# Altium schematic sheet LPCXpresso55SXX_POWER-USB.SchDoc
size A3; CheckedBy: José Ogando; Engineer: Eduardo Teofilo; Revision: A2; SheetNumber: 2; SheetTotal: 8
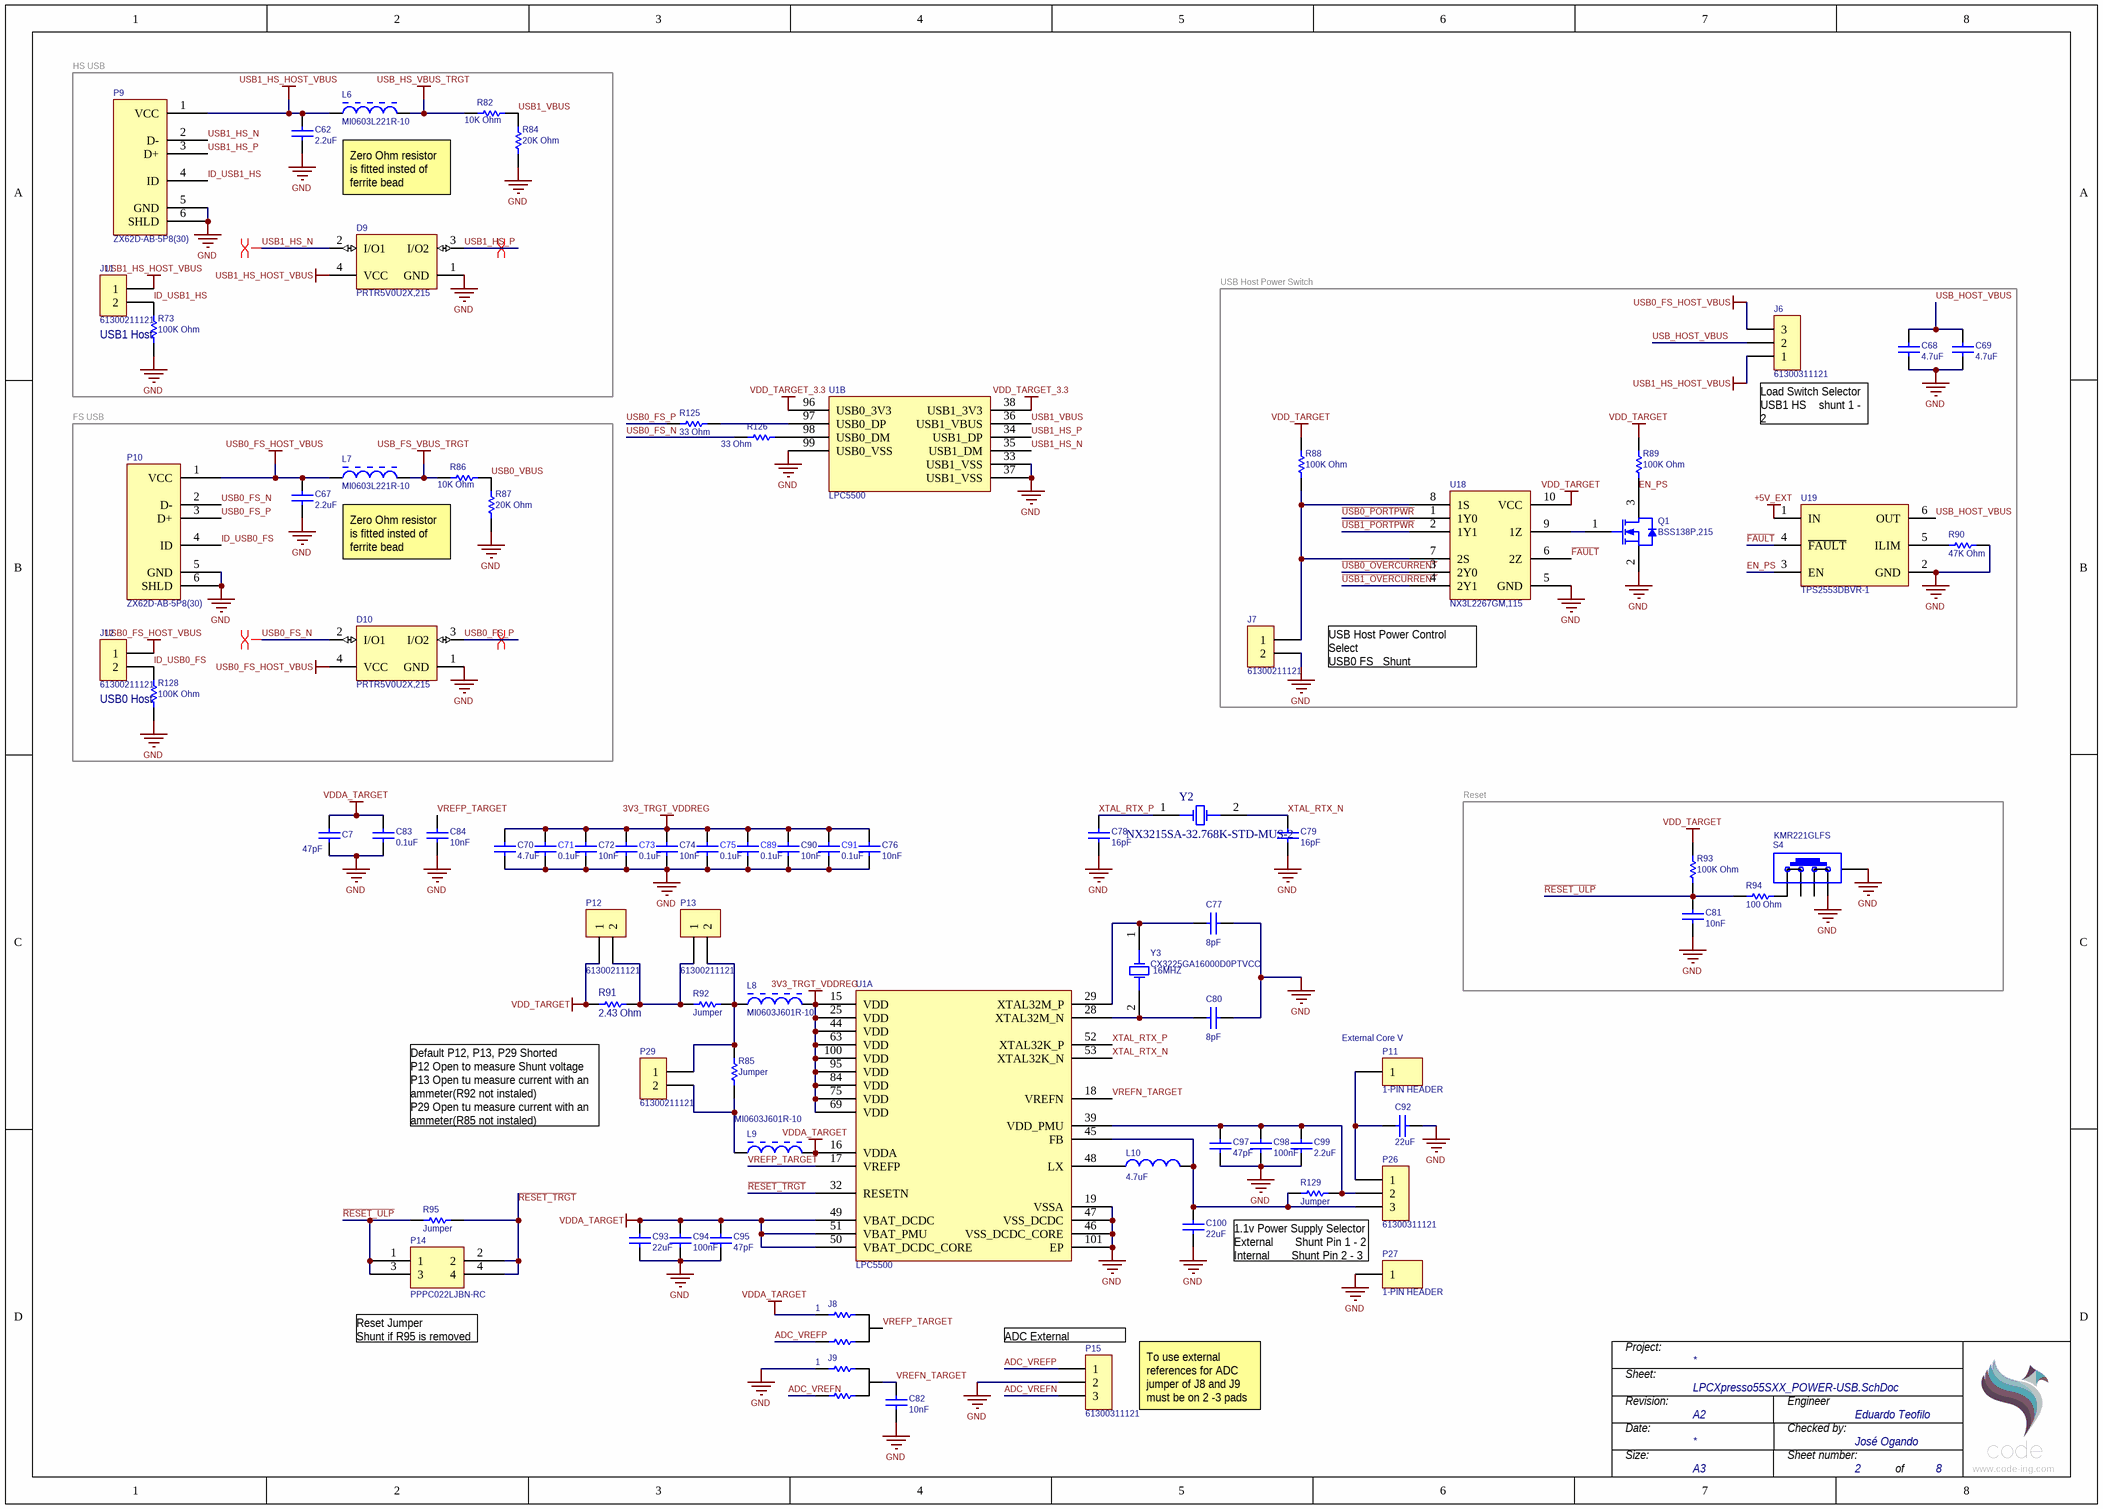
[diagram p0: LPCXpresso55SXX_POWER-USB.SchDoc]

## Parts
C7  value 47pF  [CAPC0402(1005)60_L]  (hidden comment: CAP 47pF 16V 0402(1005))
C62  value 2.2uF  [CAPC0402(1005)60_L]  (hidden comment: CAP 2.2uF 10V 0402(1005))
C67  value 2.2uF  [CAPC0402(1005)60_L]  (hidden comment: CAP 2.2uF 10V 0402(1005))
C68  value 4.7uF  [CAPC0603(1608)100_L]  (hidden comment: CAP 4.7uF 10V 0603(1608))
C69  value 4.7uF  [CAPC0603(1608)100_L]  (hidden comment: CAP 4.7uF 10V 0603(1608))
C70  value 4.7uF  [CAPC0603(1608)100_L]  (hidden comment: CAP 4.7uF 10V 0603(1608))
C71  value 0.1uF  [CAPC1005]  (hidden comment: CC0402KRX7R7BB104)
C72  value 10nF  [CAPC0402(1005)60_L]  (hidden comment: CAP 10nF 25V 0402(1005))
C73  value 0.1uF  [CAPC1005]  (hidden comment: CC0402KRX7R7BB104)
C74  value 10nF  [CAPC0402(1005)60_L]  (hidden comment: CAP 10nF 25V 0402(1005))
C75  value 0.1uF  [CAPC1005]  (hidden comment: CC0402KRX7R7BB104)
C76  value 10nF  [CAPC0402(1005)60_L]  (hidden comment: CAP 10nF 25V 0402(1005))
C77  value 8pF  [0402_L]  (hidden comment: GRM1555C1E8R0CA01D)
C78  value 16pF  [CAPC0402(1005)60_L]  (hidden comment: CAP 16pF 25V 0402(1005))
C79  value 16pF  [CAPC0402(1005)60_L]  (hidden comment: CAP 16pF 25V 0402(1005))
C80  value 8pF  [0402_L]  (hidden comment: GRM1555C1E8R0CA01D)
C81  value 10nF  [CAPC0402(1005)60_L]  (hidden comment: CAP 10nF 25V 0402(1005))
C82  value 10nF  [CAPC0402(1005)60_L]  (hidden comment: CAP 10nF 25V 0402(1005))
C83  value 0.1uF  [CAPC1005]  (hidden comment: CC0402KRX7R7BB104)
C84  value 10nF  [CAPC0402(1005)60_L]  (hidden comment: CAP 10nF 25V 0402(1005))
C89  value 0.1uF  [CAPC1005]  (hidden comment: CC0402KRX7R7BB104)
C90  value 10nF  [CAPC0402(1005)60_L]  (hidden comment: CAP 10nF 25V 0402(1005))
C91  value 0.1uF  [CAPC1005]  (hidden comment: CC0402KRX7R7BB104)
C92  value 22uF  [CAPC0805(2012)145_L]  (hidden comment: CAP 22uF 16V 0805(2012))
C93  value 22uF  [CAPC0805(2012)145_L]  (hidden comment: CAP 22uF 16V 0805(2012))
C94  value 100nF  [CAPC0603(1608)100_L]  (hidden comment: CAP 100nF 25V 0603(1608))
C95  value 47pF  [CAPC0603(1608)100_L]  (hidden comment: CAP 47pF 16V 0603(1608))
C97  value 47pF  [CAPC0603(1608)100_L]  (hidden comment: CAP 47pF 16V 0603(1608))
C98  value 100nF  [CAPC0603(1608)100_L]  (hidden comment: CAP 100nF 25V 0603(1608))
C99  value 2.2uF  [CAPC0402(1005)60_L]  (hidden comment: CAP 2.2uF 10V 0402(1005))
C100  value 22uF  [CAPC0805(2012)145_L]  (hidden comment: CAP 22uF 16V 0805(2012))
D9  PRTR5V0U2X,215  [NXP-SOT143B-4_V]
D10  PRTR5V0U2X,215  [NXP-SOT143B-4_V]
J6  61300311121  [61300311121]
J7  61300211121  [61300211121]
J8  Resistor - Jumper  [0402_R - JMP]  (value not drawn)
J9  Resistor - Jumper  [0402_R - JMP]  (value not drawn)
J11  61300211121  [61300211121]
J12  61300211121  [61300211121]
L6  MI0603L221R-10  [LIRD-HZ0603C601R-10-2_V]
L7  MI0603L221R-10  [LIRD-HZ0603C601R-10-2_V]
L8  MI0603J601R-10  [LIRD-MI0603J601R-10_V]
L9  MI0603J601R-10  [LIRD-MI0603J601R-10_V]
L10  value 4.7uF  [0805(2012)]  (hidden comment: MLZ2012M4R7HT000)
P9  ZX62D-AB-5P8(30)  [ZX62D-AB-5P8(30)]
P10  ZX62D-AB-5P8(30)  [ZX62D-AB-5P8(30)]
P11  1-PIN HEADER  [HDR1X1]
P12  61300211121  [61300211121]
P13  61300211121  [61300211121]
P14  PPPC022LJBN-RC  [PPPC022LJBN-RC]
P15  61300311121  [61300311121]
P26  61300311121  [61300311121]
P27  1-PIN HEADER  [HDR1X1]
P29  61300211121  [61300211121]
Q1  BSS138P,215  [NXP-SOT23_N]
R73  value 100K Ohm  [RESC1005X40X25LL05T05]  (hidden comment: ERJ-2RKF1003X)
R82  value 10K Ohm  [RESC0402(1005)_N]  (hidden comment: 10K 1% 0402(1005))
R84  value 20K Ohm  [RESC0402(1005)_M]  (hidden comment: 20K 1% 0402(1005))
R85  Jumper  [RESC0402(1005)_L]
R86  value 10K Ohm  [RESC0402(1005)_N]  (hidden comment: 10K 1% 0402(1005))
R87  value 20K Ohm  [RESC0402(1005)_M]  (hidden comment: 20K 1% 0402(1005))
R88  value 100K Ohm  [RESC1005X40X25LL05T05]  (hidden comment: ERJ-2RKF1003X)
R89  value 100K Ohm  [RESC1005X40X25LL05T05]  (hidden comment: ERJ-2RKF1003X)
R90  value 47K Ohm  [RESC0402(1005)_L]  (hidden comment: 47K 1% 0402(1005))
R91  value 2.43 Ohm  [RESC0402(1005)_L]  (hidden comment: 2R43 1% 0402(1005))
R92  Jumper  [RESC0402(1005)_L]
R93  value 100K Ohm  [RESC1005X40X25LL05T05]  (hidden comment: ERJ-2RKF1003X)
R94  value 100 Ohm  [RESC0402(1005)_L]  (hidden comment: 100R 5% 0402(1005))
R95  Jumper  [RESC0402(1005)_L]
R125  value 33 Ohm  [RESC0402(1005)_L]  (hidden comment: 33R 1% 0402(1005))
R126  value 33 Ohm  [RESC0402(1005)_L]  (hidden comment: 33R 1% 0402(1005))
R128  value 100K Ohm  [RESC1005X40X25LL05T05]  (hidden comment: ERJ-2RKF1003X)
R129  Jumper  [RESC0402(1005)_L]
S4  KMR221GLFS  [KMR221GLFS]
U1  LPC5500  [LQFP EP 100]  (parts A,B of 4)
U18  NX3L2267GM,115  [XQFN10]
U19  TPS2553DBVR-1  [DBV0006A_N]
Y2  NX3215SA-32.768K-STD-MUS-2  [2-SMD 3.2x1.5mm]
Y3  CX3225GA16000D0PTVCC  value 16MHZ  [CX3225GA]

## Blocks framed on the sheet
USB1 Host: C62 D9 J11 L6 P9 R73 R82 R84
USB Host Power Switch: C68 C69 J6 J7 Q1 R88-R90 U18 U19
USB0 Host: C67 D10 J12 L7 P10 R86 R87 R128
Reset: C81 R93 R94 S4

## Nets
3V3_TRGT_VDDREG: C70.2 C71.1 C72.2 C73.1 C74.2 C75.1 C76.2 C89.1 C90.2 C91.1 L8.2 U1.15(VDD) U1.25(VDD) U1.44(VDD) U1.63(VDD) U1.69(VDD) U1.75(VDD) U1.84(VDD) U1.95(VDD) U1.100(VDD)
+5V_EXT: U19.1(IN)
GND: C7.1 C62.1 C67.1 C68.1 C69.1 C70.1 C71.2 C72.1 C73.2 C74.1 C75.2 C76.1 C77.2 C78.1 C79.1 C80.2 C81.1 C82.1 C83.2 C84.1 C89.2 C90.1 C91.2 C92.2 C93.1 C94.1 C95.1 C97.1 C98.1 C99.1 C100.2 D9.1(GND) D10.1(GND) J7.2 J9.1 P9.5(GND) P9.6(SHLD) P10.5(GND) P10.6(SHLD) P15.2 P27.1 Q1.2(S) R73.1 R84.1 R87.1 R90.2 R128.1 S4.2 S4.5 U1.19(VSSA) U1.33(USB1_VSS) U1.37(USB1_VSS) U1.46(VSS_DCDC_CORE) U1.47(VSS_DCDC) U1.99(USB0_VSS) U1.101(EP) U18.5(GND) U19.2(GND)
USB0_FS_HOST_VBUS: C67.2 D10.4(VCC) J6.3 J12.1 L7.1 P10.1(VCC)
USB1_HS_HOST_VBUS: C62.2 D9.4(VCC) J6.1 J11.1 L6.1 P9.1(VCC)
USB_FS_VBUS_TRGT: L7.2 R86.1
USB_HS_VBUS_TRGT: L6.2 R82.1
VDD_TARGET: P12.1 R88.2 R89.2 R91.1 R93.2 U18.10(VCC)
VDD_TARGET_3.3: U1.38(USB1_3V3) U1.96(USB0_3V3)
VDDA_TARGET: C7.2 C83.1 C93.2 C94.2 C95.2 J8.1 L9.2 U1.16(VDDA) U1.49(VBAT_DCDC) U1.50(VBAT_DCDC_CORE) U1.51(VBAT_PMU)
ADC_VREFN: J9.3 P15.3
ADC_VREFP: J8.3 P15.1
EN_PS: Q1.3(D) R89.1 U19.3(EN)
~{FAULT}: U18.6(2Z) U19.4(~{FAULT})
ID_USB0_FS: J12.2 P10.4(ID) R128.2
ID_USB1_HS: J11.2 P9.4(ID) R73.2
~{RESET_TRGT}: P14.2 P14.4 R95.1 U1.32(RESETN)
~{RESET_ULP}: C81.2 P14.1 P14.3 R93.1 R94.1 R95.2
~{USB0_OVERCURRENT}: U18.3(2Y0)
~{USB0_PORTPWR}: U18.1(1Y0)
~{USB1_OVERCURRENT}: U18.4(2Y1)
~{USB1_PORTPWR}: U18.2(1Y1)
USB0_FS_N: D10.2(I/O1) P10.2(D-) R126.1
USB0_FS_P: D10.3(I/O2) P10.3(D+) R125.1
USB0_VBUS: R86.2 R87.2
USB1_HS_N: D9.2(I/O1) P9.2(D-) U1.35(USB1_DM)
USB1_HS_P: D9.3(I/O2) P9.3(D+) U1.34(USB1_DP)
USB1_VBUS: R82.2 R84.2 U1.36(USB1_VBUS)
USB_HOST_VBUS: C68.2 C69.2 J6.2 U19.6(OUT)
VREFN_TARGET: C82.2 J9.2 U1.18(VREFN)
VREFP_TARGET: C84.2 J8.2 U1.17(VREFP)
XTAL_RTX_N: C79.2 U1.53(XTAL32K_N) Y2.2(OSC2)
XTAL_RTX_P: C78.2 U1.52(XTAL32K_P) Y2.1(OSC1)
NetC77_1: C77.1 U1.29(XTAL32M_P) Y3.1(OSC1)
NetC80_1: C80.1 U1.28(XTAL32M_N) Y3.2
NetC92_1: C92.1 P11.1 P26.1
NetC97_2: C97.2 C98.2 C99.2 P26.2 R129.1 U1.39(VDD_PMU)
NetC100_1: C100.1 L10.2 P26.3 R129.2 U1.45(FB)
NetJ7_1: J7.1 R88.1 U18.7(2S) U18.8(1S)
NetL8_1: L8.1 P13.2 P29.1 R85.1 R92.1
NetL9_1: L9.1 P29.2 R85.2
NetL10_1: L10.1 U1.48(LX)
NetP12_2: P12.2 P13.1 R91.2 R92.2
NetQ1_1: Q1.1(G) U18.9(1Z)
NetR90_1: R90.1 U19.5(ILIM)
NetR94_2: R94.2 S4.1
NetR125_2: R125.2 U1.97(USB0_DP)
NetR126_2: R126.2 U1.98(USB0_DM)

Not connected (* = marked no-connect by the designer): S4 3 4

## Layout directives
differential pair: USB0_FS_N, USB0_FS_P, USB1_HS_N, USB1_HS_P

## Notes on the sheet
- HS USB
- Zero Ohm resistor is fitted insted of ferrite bead
- FS USB
- (near J6) Load Switch Selector
  USB1 HS    shunt 1 - 2
  USB0 FS     shunt 2 -3
- USB Host Power Control Select
  USB0 FS   Shunt
  USB1 HS  Open
- (near P11) External Core V
- (near R91) Default P12, P13, P29 Shorted
  P12 Open to measure Shunt voltage
  P13 Open tu measure current with an ammeter(R92 not instaled)
  P29 Open tu measure current with an ammeter(R85 not instaled)
- 1.1v Power Supply Selector
  External       Shunt Pin 1 - 2
  Internal       Shunt Pin 2 - 3
- (near J8) 1
- (near P14) Reset Jumper
  Shunt if R95 is removed
- (near J9) 1
- (near P15) ADC External References
- To use external references for ADC jumper of J8 and J9 must be on 2 -3 pads
- Project:
- Sheet:
- Revision:
- Date:
- Size:
- Sheet number:
- Engineer
- Checked by:
- A3
- of
- www.code-ing.com

## Library data of the parts
C7 = CMP-1034-01078-1: CAP 47pF 16V ±1% 0402 (1005 Metric) Thickness 0.6mm SMD; Tolerance: Â±1%; Case-EIA: 0402; Case-Metric: 1005; Technology: SMT; Rated Voltage: 16 V; Max Thickness: 0.6 mm
C62 C67 C99 = CMP-1034-02127-1: CAP 2.2uF 10V ±10% 0402 (1005 Metric) Thickness 0.6mm SMD; Case-EIA: 0402; Tolerance: Â±10%; Case-Metric: 1005; Technology: SMT; Rated Voltage: 10 V; Max Thickness: 0.6 mm
C68-C70 = CMP-1035-02785-1: CAP 4.7uF 10V ±10% 0603 (1608 Metric) Thickness 1mm SMD; Tolerance: Â±10%; Case-EIA: 0603; Case-Metric: 1608; Max Thickness: 1 mm; Technology: SMT; Rated Voltage: 10 V
C71 C73 C75 C83 C89 C91 = CMP-0001-00074-1: Capacitor, Yageo, Ceramic, 0.1uF 10% 16V 0402 (1005) X7R; Polarity: Non-Polarized; ClassName: Board Template Device; Rated Voltage: 16 V; Status: Production; Tolerance: 10 %; Mounting Technology: Surface Mount; Technology: Ceramic; Category: Capacitor; Dielectric: X7R; Publisher: Altium
C72 C74 C76 C81 C82 C84 C90 = CMP-1034-01880-1: CAP 10nF 25V ±10% 0402 (1005 Metric) Thickness 0.6mm SMD; Tolerance: Â±10%; Case-Metric: 1005; Case-EIA: 0402; Technology: SMT; Max Thickness: 0.6 mm; Rated Voltage: 25 V
C77 C80 = Capacitor: CAP CER 8PF 25V C0G/NP0 0402; Manufacturer: Murata Electronics North America; Modified by: *; DigiKey: *; Indications: *; Manufacturer part #: GRM1555C1E8R0CA01D; Created by: *; Creation date: *
C78 C79 = CMP-1034-00833-1: CAP 16pF 25V ±0.5pF 0402 (1005 Metric) Thickness 0.6mm SMD; Tolerance: Â±0.5pF; Case-EIA: 0402; Case-Metric: 1005; Rated Voltage: 25 V; Max Thickness: 0.6 mm; Technology: SMT
C92 C93 C100 = CMP-1036-04946-1: CAP 22uF 16V ±20% 0805 (2012 Metric) Thickness 1.45mm SMD; Tolerance: Â±20%; Case-Metric: 2012; Case-EIA: 0805; Max Thickness: 1.45 mm; Rated Voltage: 16 V; Technology: SMT
C94 C98 = CMP-1035-02589-1: CAP 100nF 25V ±20% 0603 (1608 Metric) Thickness 1mm SMD; Case-EIA: 0603; Tolerance: Â±20%; Case-Metric: 1608; Max Thickness: 1 mm; Technology: SMT; Rated Voltage: 25 V
C95 C97 = CMP-1035-01048-1: CAP 47pF 16V ±5pF 0603 (1608 Metric) Thickness 1mm SMD; Case-EIA: 0603; Case-Metric: 1608; Technology: SMT; Tolerance: ±5pF; Rated Voltage: 16 V; Max Thickness: 1 mm
D9 D10 = CMP-2000-05285-1: Ultra Low Capacitance Double Rail-to-Rail ESD Protection Diode, 5.5 V, 1 pF, -40 to 85 degC, 4-Pin SOT143B, RoHS, Tape and Reel; Manufacturer: NXP Semiconductors; Capacitance Value: 16pF; Number of Elements: 1; Rad Hardened: No; Reverse Breakdown Voltage: 6V; Working Voltage (Max): 5.5V; Polarity: Uni-Directional; Configuration: Quad; Leakage Current: 0.1uA; Product Height (mm): 1mm; Suppressor Type: DiodeArrays; Product Length (mm): 3mm; Product Depth (mm): 1.4mm; ESD Protection Voltage: 8KV@ContactDisc; Package Type: SOT; Mounting: SurfaceMount; Packaging: TapeandReel; Datasheet Version: Rev. 02, 01/2008; Reverse Stand-off Voltage: 5.5V; Manufacturer URL: http://www.nxp.com/; Operating Temp Range: -40Cto85C; Operating Temperature Classification: Industrial; Working Voltage: 5.5V; Operating Temperature Min Deg. C: -40C; Datasheet URL: https://datasheet.ciiva.com/4479/prtr5v0u2x-102853-4479461.pdf; Leakage Current (Max): 0.1uA; Direction Type: Uni-Directional; Pin Count: 3+Tab; Operating Temperature Max Deg. C: 85C; Mounting Style: SurfaceMount; Package / Case: SOT
J6 = 61300311121: HEADER 3POS SNGL T/H 2.54MM; Manufacturer: Wurth Electronics Inc; Manufacturer part #: 61300311121; DigiKey: *; Modified by: *; Value: *; Created by: gmoreno; Creation date: 28-Jul-2012
J7 = 61300211121: HEADER 2POS SNGL T/H 2.54MM; Manufacturer: Wurth Electronics Inc; Manufacturer part #: 61300211121; Modified by: *; Value: *; Created by: gmoreno; Creation date: 28-Jul-2012
J8 J9 = Resistor - Jumper: *; Indications: *; Created by: *; Creation date: *; Manufacturer: *; Manufacturer part #: *; Modified by: *; Value: *
J11 J12 P12 P13 P29 = 61300211121: HEADER 2POS SNGL T/H 2.54MM; Manufacturer: Wurth Electronics Inc; Indications: DNI; Manufacturer part #: 61300211121; Modified by: *; Value: *; Created by: gmoreno; Creation date: 28-Jul-2012
L6 L7 = CMP-2000-06701-1: Chip Bead, 100 MHz, 2 A, -40 to 125 degC, 2-Pin SMD (0603), RoHS, Tape and Reel; Case Height: 0.5mm; Impedance: 220Ohms; Maximum DC Resistance: 80mOhms; Brand: LairdTechnologies; Case Length: 1.6mm; Maximum DC Current: 2A; Unit Weight: 0.000192oz; Test Frequency: 100MHz; Package Description: 2-Pin Surface Mount Device, Body 1.6 x 0.8 mm; Datasheet URL: http://cdn.lairdtech.com/home/brandworld/files/MI0603L221R-10.pdf; Package Reference: 0603; Factory Pack Quantity: 4000; Mounting Technology: SurfaceMount; Packaging: Reel; Case Width: 0.5mm; Operating Temperature Range: -40Cto+125C; Dimensions: 0.5mmWx1.6mmLx0.5mmH; Package / Case: 0603(1608metric); Product Category: EMIFilterBeads,Chips&Arrays; Series: MI; Manufacturer URL: https://www.lairdtech.com/; Termination Style: SMD/SMT; Manufacturer: LairdTechnologies; Product: FerriteChipBeads; Datasheet Version: Rev. E, 08/2013; RoHS: Details
L8 L9 = CMP-2000-06700-1: Ferrite Bead, 600 Ohm, 1 A, -40 to 125 degC, 2-Pin SMD, RoHS, Tape and Reel; Manufacturer: Laird; DC Resistance (DCR) (Max): 200mOhm; Online Catalog: MISeries; Number of Lines: 1; Kits: 240-2227-ND-KITEMIFERRITEBEADCHIPSMD; Other Names: 240-2371-1; Impedance @ Frequency: 600Ohm@100MHz; Filter Type: PowerLine; Current Rating (Max): 1A; Catalog Drawings: (HI,HZ,LI,MI)0603Series_0.95mmMax.Height; Datasheet Version: Rev. C, 08/2013; Ratings: -; Package Description: 2-Pin Surface Mount Device, Body 1.6 x 0.8 mm; Operating Temperature: -40°C~125°C; Category: Filters; Mounting Type: SurfaceMount; Size / Dimension: 0.063"Lx0.031"W(1.60mmx0.80mm); Family: FerriteBeadsandChips; Package Reference: MI00603J601R-10; Manufacturer URL: https://www.lairdtech.com/; Height (Max): 0.037"(0.95mm); Series: MI; Packaging: CutTape(CT); Mounting Technology: SurfaceMount; Package / Case: 0603(1608Metric); Standard Package: 1; Datasheet URL: http://cdn.lairdtech.com/home/brandworld/files/MI0603J601R-10.pdf
L10 = MLZ2012M4R7HT000: FIXED IND 4.7UH 400MA 340 MOHM; Manufacturer: TDK Corporation; Manufacturer part #: MLZ2012M4R7HT000; Indications: *; Modified by: *; Created by: eteofilo; Creation date: 06-Nov-2018
P9 P10 = ZX62D-AB-5P8(30): CONN RCPT USB MICRO AB SMD; Manufacturer: Hirose Electric Co Ltd; Manufacturer part #: ZX62D-AB-5P8(30); Created by: eteofilo; Creation date: 16-Apr-2018; Modified by: *; Value: *; Indications: *
P11 P27 = 1-PIN HEADER: PTH HEADER 40MIL DRILL 70MIL PAD; Indications: DNI
P14 = PPPC022LJBN-RC: CONN FEMALE 4POS DL .1" R/A GOLD; Manufacturer: Sullins Connector Solutions; Indications: DNI; Manufacturer Part #: PPPC022LJBN-RC; Created by: eteofilo; Creation date: 30-May-2018; Modified by: *; Value: *
P15 P26 = 61300311121: HEADER 3POS SNGL T/H 2.54MM; Manufacturer: Wurth Electronics Inc; Indications: DNI; Manufacturer part #: 61300311121; DigiKey: *; Modified by: *; Value: *; Created by: gmoreno; Creation date: 28-Jul-2012
Q1 = CMP-1259-00085-1: N-Channel Trench MOSFET, 60 V, 0.36 A, -55 to 150 degC, 3-Pin SOT23, Tape and Reel; Manufacturer: NXP Semiconductors; IDM [max] (A): 1.2; Channel Type: N; VDS [max] (V): 60; Packing: Tape & Reel; Automotive Qualified: Y; ID [max] (A): 0.36; ComponentLink1URL: http://www.nxp.com/; ComponentLink1Description: Manufacturer URL; Code_JEDEC: TO-236AB; PackageReference: SOT23; PartNumber: BSS138P,215; ComponentLink2URL: http://www.nxp.com/documents/data_sheet/BSS138P.pdf; PackageDescription: 3-Pin Small Outline Transistor Package, Body 2.9 x 1.3 mm, Pitch 0.95 mm; VGSth [typ] (V): 1.2; DatasheetVersion: Rev. 1; Mounting Technology: Surface Mount; ComponentLink3URL: http://www.nxp.com/documents/outline_drawing/sot023_po.pdf; ComponentLink3Description: Package Specification; ComponentLink2Description: Datasheet; PackageVersion: 06-03-16, 03/2006
R73 R128 = CMP-2002-00608-3: Chip Resistor, 100 KOhm, +/- 1%, 100 mW, -55 to 155 degC, 0402 (1005 Metric), RoHS, Tape and Reel; Manufacturer: Basic Passives; Power Rating: 100 mW; Voltage Rating: 50 V; Case\/Package: 0402; Indications: DNI; Case Code (Imperial): 0402; RoHSCompliant: true; Min Operating Temperature: -55 degC; Mount: Surface Mount; Packaging: Tape and Reel; PackageDescription: 2-Pin Surface Mount Device, Body 1 x 0.5 mm; Tolerance: 1%; REACH SVHC: Yes; ComponentLink1URL: http://www.panasonic.com/; ComponentLink1Description: Manufacturer URL; Package Quantity: 10000; Mounting Technology: Surface Mount; DatasheetVersion: 04/2015; PartNumber: ERJ-2RKF1003X; Height: 0.35 mm; Pins: 2; Length: 1 mm; Max Operating Temperature: 155 degC; ComponentLink2Description: Datasheet; ComponentLink2URL: http://industrial.panasonic.com/cdbs/www-data/pdf/RDA0000/AOA0000C86.pdf; PackageReference: 0402; Radiation Hardening: No; Width: 0.5 mm; Case Code (Metric): 1005
R82 R86 = CMP-1011-00623-1: 10K 0.063W 1% 0402 (1005 Metric)  SMD; Case-Metric: 1005; Case-EIA: 0402; Tolerance: 1 %; Technology: SMT; Power: 0.063 W
R84 R87 = CMP-1011-00655-1: 20K 0.063W 1% 0402 (1005 Metric)  SMD; Case-EIA: 0402; Case-Metric: 1005; Technology: SMT; Power: 0.063 W; Tolerance: 1 %
R85 R92 R95 R129 = CMP-1011-00001-1: Jumper 0402 (1005 Metric); Tolerance: None; Case-Metric: 1005; Case-EIA: 0402; Value: 0 Ohm; Power: None; Technology: SMT
R88 R89 R93 = CMP-2002-00608-3: Chip Resistor, 100 KOhm, +/- 1%, 100 mW, -55 to 155 degC, 0402 (1005 Metric), RoHS, Tape and Reel; Manufacturer: Basic Passives; Power Rating: 100 mW; Voltage Rating: 50 V; Case\/Package: 0402; Case Code (Imperial): 0402; RoHSCompliant: true; Min Operating Temperature: -55 degC; Mount: Surface Mount; Packaging: Tape and Reel; PackageDescription: 2-Pin Surface Mount Device, Body 1 x 0.5 mm; Tolerance: 1%; REACH SVHC: Yes; ComponentLink1URL: http://www.panasonic.com/; ComponentLink1Description: Manufacturer URL; Package Quantity: 10000; Mounting Technology: Surface Mount; DatasheetVersion: 04/2015; PartNumber: ERJ-2RKF1003X; Height: 0.35 mm; Pins: 2; Length: 1 mm; Max Operating Temperature: 155 degC; ComponentLink2Description: Datasheet; ComponentLink2URL: http://industrial.panasonic.com/cdbs/www-data/pdf/RDA0000/AOA0000C86.pdf; PackageReference: 0402; Radiation Hardening: No; Width: 0.5 mm; Case Code (Metric): 1005
R90 = CMP-1011-00699-1: 47K 0.063W 1% 0402 (1005 Metric)  SMD; Case-EIA: 0402; Case-Metric: 1005; Power: 0.063 W; Technology: SMT; Tolerance: 1 %
R91 = CMP-1011-00213-1: 2R43 0.063W 1% 0402 (1005 Metric)  SMD; Case-EIA: 0402; Case-Metric: 1005; Technology: SMT; Power: 0.063 W; Tolerance: 1 %
R94 = CMP-1011-00050-1: 100R 0.063W 5% 0402 (1005 Metric)  SMD; Case-Metric: 1005; Case-EIA: 0402; Power: 0.063 W; Technology: SMT; Tolerance: 5 %
R125 R126 = CMP-1011-00341-1: 33R 0.063W 1% 0402 (1005 Metric)  SMD; Case-Metric: 1005; Case-EIA: 0402; Tolerance: 1 %; Power: 0.063 W; Technology: SMT
S4 = KMR221GLFS: SWITCH TACTILE SPST-NO 0.05A 32V; Manufacturer: C&K; Created by: eteofilo; Creation Date: 06-Jul-2017; Indications: *; Manufacturer part #: KMR221GLFS; Modified by: *; Value: *
U1 = LPC5500: 32-bit ARM Cortex-M33, 312 KB SRAM, LPC55XX Series; Manufacturer: NXP; Manufacturer Part #: LPC5500; Created by: eteofilo; Creation Date: 05-Apr-2018; Modified by: *; Indications: *; Value: *
U18 = NX3L2267GM,115: IC ANALOG SWITCH SPDT 10XQFN; Manufacturer: NXP USA Inc.; Manufacturer part #: NX3L2267GM,115; Indications: *; Modified by: *; Creation date: 16-Apr-2018; Created by: eteofilo; Value: *
U19 = CMP-0337-00282-2: Adjustable, Active High, Latch-off, Current-Limited Power-Distribution Switch, 0.075 to 1.7 A Current Limit, -40 to 85 degC, 6-pin SOT-23 (DBV), Green (RoHS & no Sb/Br); Manufacturer: Texas Instruments; rDS(on) per FET(Typ)(mOhms): 100/DRV, 85/DBV; Vin(Max)(V): 6.5; Continuous Current(Max)(A): 1.5; Current Limit Accuracy @ 1A: +/-7.5% (925mA min / 1075mA max); Rating: Catalog; Number of Switches: 1; Vin(Min)(V): 2.5; Enable: Active High; Current Limit(A): 0.075 to 1.7; Code_JEDEC: MO-178-AB*; Current Limit Topology: Latch-off; Mounting Technology: Surface Mount; PackageDescription: 6-Pin Plastic Small-Outline Package, 2.9 x 1.6 mm Body, 0.95 mm Pitch, 2.8 mm Lead Span; PartNumber: TPS2553DBVR-1; Eco-Plan: Green (RoHS & no Sb/Br); DatasheetVersion: SLVS841E; ComponentLink1Description: Datasheet; PackageVersion: revK, Mar-2006; ComponentLink1URL: http://www.ti.com/general/docs/lit/getliterature.tsp?genericPartNumber=TPS2553-1&fileType=pdf; PackageReference: DBV0006A
Y2 = NX3215SA-32.768K-STD-MUS-2: CRYSTAL 32.7680KHZ 12.5PF SMD; Manufacturer: NDK; Value: 32.768KHz; Manufacturer Part #: NX3215SA-32.768K-STD-MUS-2; Creation Date: 05-Jun-2018; Created by: eteofilo; Modified by: *; Indications: *
Y3 = CX3225GA16000D0PTVCC: CRYSTAL 16.0000MHZ 8PF SMD; Manufacturer: Kyocera International Inc. Electronic Components; Manufacturer part #: CX3225GA16000D0PTVCC; Indications: *; Modified by: *; Created by: eteofilo; Creation date: 25-May-2018